# EAGLE design I2Sspeaker (EAGLE 7.6.0)
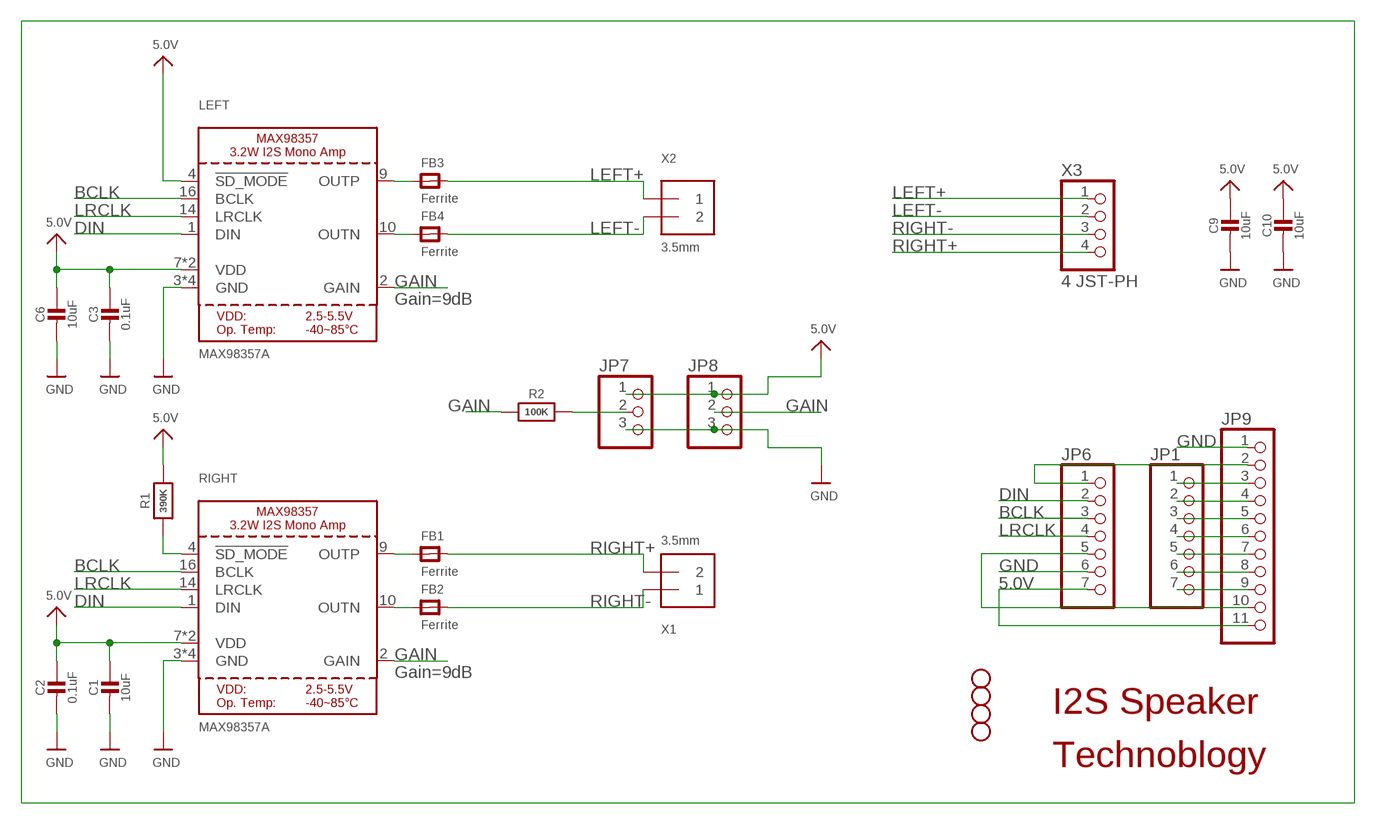
[diagram p0: schematic, sheet 1]

## Parts
C1  10uF  CAP_CERAMIC0805-NOOUTLINE  [0805-NO]
C2  0.1uF  CAP_CERAMIC0805-NOOUTLINE  [0805-NO]
C3  0.1uF  CAP_CERAMIC0805-NOOUTLINE  [0805-NO]
C6  10uF  CAP_CERAMIC0805-NOOUTLINE  [0805-NO]
C9  10uF  CAP_CERAMIC0805-NOOUTLINE  [0805-NO]
C10  10uF  CAP_CERAMIC0805-NOOUTLINE  [0805-NO]
FB1  Ferrite  FERRITE-0805NO  [0805-NO]
FB2  Ferrite  FERRITE-0805NO  [0805-NO]
FB3  Ferrite  FERRITE-0805NO  [0805-NO]
FB4  Ferrite  FERRITE-0805NO  [0805-NO]
JP1  HEADER-1X7ROUND  [1X07_ROUND]
JP2  STAND-OFF  [STAND-OFF]
JP3  STAND-OFF  [STAND-OFF]
JP4  STAND-OFF  [STAND-OFF]
JP5  STAND-OFF  [STAND-OFF]
JP6  HEADER-1X7ROUND  [1X07_ROUND]
JP7  HEADER-1X3ROUND  [1X03_ROUND]
JP8  HEADER-1X3ROUND  [1X03_ROUND]
JP9  HEADER-1X11  [1X11_ROUND]
LEFT  MAX98357A  AUDIOAMP_MAX98357  [QFN16_3MM]
R1  390K  RESISTOR0805_NOOUTLINE  [0805-NO]
R2  100K  RESISTOR0805_NOOUTLINE  [0805-NO]
RIGHT  MAX98357A  AUDIOAMP_MAX98357  [QFN16_3MM]
X1  3.5mm  TERMBLOCK_1X2  [TERMBLOCK_1X2-3.5MM]
X2  3.5mm  TERMBLOCK_1X2  [TERMBLOCK_1X2-3.5MM]
X3  4 JST-PH  CON_JST_PH_4PIN  [JSTPH4]

## Nets
5.0V: C1.1 C2.1 C3.1 C6.1 C9.1 C10.1 JP6.7 JP7.1 JP8.1 JP9.11 LEFT.4(!SD_MODE) LEFT.7(VDD) LEFT.8(VDD) R1.2 RIGHT.7(VDD) RIGHT.8(VDD)
BCLK: JP6.3 LEFT.16(BCLK) RIGHT.16(BCLK)
DIN: JP6.2 LEFT.1(DIN) RIGHT.1(DIN)
GAIN: JP8.2 LEFT.2(GAIN) R2.1 RIGHT.2(GAIN)
GND: C1.2 C2.2 C3.2 C6.2 C9.2 C10.2 JP6.6 JP7.3 JP8.3 JP9.1 LEFT.3(GND) LEFT.11(GND) LEFT.15(GND) LEFT.THERMAL(GND) RIGHT.3(GND) RIGHT.11(GND) RIGHT.15(GND) RIGHT.THERMAL(GND)
LEFT+: FB3.2 X2.1 X3.1
LEFT-: FB4.2 X2.2 X3.2
LRCLK: JP6.4 LEFT.14(LRCLK) RIGHT.14(LRCLK)
N$1: FB4.1 LEFT.10(OUTN)
N$2: FB3.1 LEFT.9(OUTP)
N$5: FB2.1 RIGHT.10(OUTN)
N$6: FB1.1 RIGHT.9(OUTP)
N$7: JP1.1 JP9.3
N$8: JP6.5 JP9.10
N$9: JP7.2 R2.2
N$10: JP1.2 JP9.4
N$11: JP1.3 JP9.5
N$12: JP1.4 JP9.6
N$13: JP1.5 JP9.7
N$14: JP1.6 JP9.8
N$15: JP1.7 JP9.9
N$16: JP6.1 JP9.2
RIGHT+: FB1.2 X1.2 X3.4
RIGHT-: FB2.2 X1.1 X3.3
SD_MODE: R1.1 RIGHT.4(!SD_MODE)

## Notes on the sheet
- Gain=9dB
- Gain=9dB
- I2S Speaker
- Technoblogy

## Library data of the parts
C1-C3 C6 C9 C10 = microbuilder:CAP_CERAMIC: Ceramic Capacitors For new designs, use the packages preceded by an '_' character since they are more reliable: The following footprints should be used on most boards: _0402 - Standard footprint for regular board layouts _0603 - Standard footprint for regular board layouts _0805 - Standard footprint for regular board layouts _1206 - Standard footprint for regular board layouts For extremely tight-pitch boards where space is at a premium, the following 'micro-pitch' footprints can be used (smaller pads, no silkscreen outline, etc.): _0402MP - Micro-pitch footprint for very dense/compact boards _0603MP - Micro-pitch footprint for very dense/compact boards _0805MP - Micro-pitch footprint for very dense/compact boards _1206MP - Micro-pitch footprint for very dense/compact boards
FB1-FB4 = microbuilder:FERRITE: Ferrite Bead 0603 MMZ1608B121C - 120 Ohm @ 100MHz, 600mA, 0.15 Ohm DC Resistance - Digikey: 445-2164-1-ND BK1608HW121-T - 120 Ohm, 600mA Ferrite Chip - Digikey: 587-1876-2-ND 0805 HZ0805B272R-10 - 2.7K Ohm @ 100MHz, 200mA, 0.8 Ohm DC Resistance - Digikey: 240-2504-1-ND (see also Murata BLM21BD272SN1L) MMZ2012Y152B - 1.5K Ohm @ 100MHz, 500mA, 0.4 Ohm DC Resistance - Digikey: 445-1560-1-ND - Mainly for high frequency (80-400MHz) MMZ2012R102A - 1K Ohm @ 100MHz, 500mA, 0.3 Ohm DC Resistance - Digikey: 445-1555-2-ND - More general purpose (10-200MHz)
JP1 JP6 = microbuilder:HEADER-1X7: PIN HEADER
JP2-JP5 = SparkFun:STAND-OFF: Stand Off This is the mechanical footprint for a #4 phillips button head screw. Use the keepout ring to avoid running the screw head into surrounding components. SKU : PRT-00447
JP7 JP8 = microbuilder:HEADER-1X3: PIN HEADER
JP9 = microbuilder:HEADER-1X11
LEFT RIGHT = microbuilder:AUDIOAMP_MAX98357: MAX98357 - 3.2W I2S Mono Audio Amp
R1 R2 = microbuilder:RESISTOR: Resistors For new designs, use the packages preceded by an '_' character since they are more reliable: The following footprints should be used on most boards: _0402 - Standard footprint for regular board layouts _0603 - Standard footprint for regular board layouts _0805 - Standard footprint for regular board layouts _1206 - Standard footprint for regular board layouts For extremely tight-pitch boards where space is at a premium, the following 'micro-pitch' footprints can be used (smaller pads, no silkscreen outline, etc.): _0402MP - Micro-pitch footprint for very dense/compact boards _0603MP - Micro-pitch footprint for very dense/compact boards _0805MP - Micro-pitch footprint for very dense/compact boards _1206MP - Micro-pitch footprint for very dense/compact boards
X1 X2 = microbuilder:TERMBLOCK_1X2: 3.5mm Terminal block http://www.ladyada.net/library/pcb/eaglelibrary.html
X3 = microbuilder:CON_JST_PH_4PIN: JST 4-Pin Right-Angle Connector 4UConnector: 17312

## Net classes
0 default: width 0.152 mm, drill 0.305 mm, clearance 0.152 mm

## Board
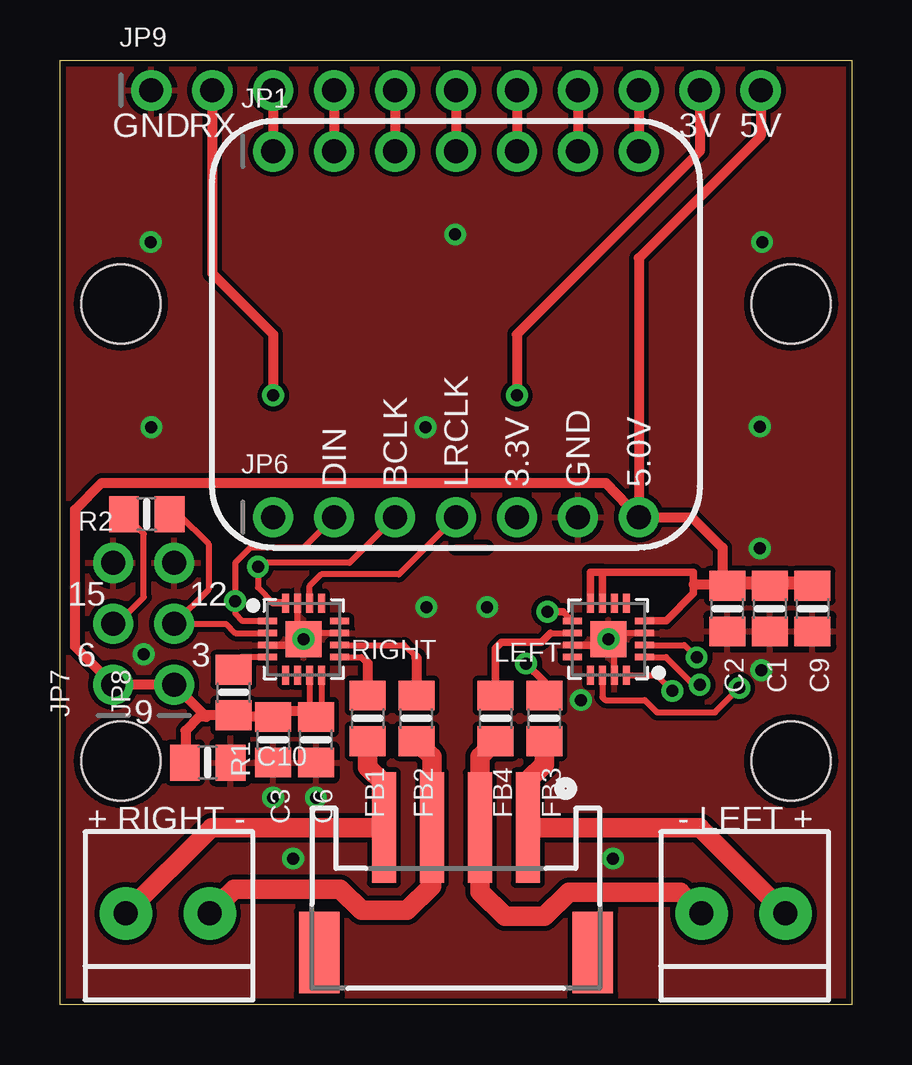
[diagram p1: board, top side]
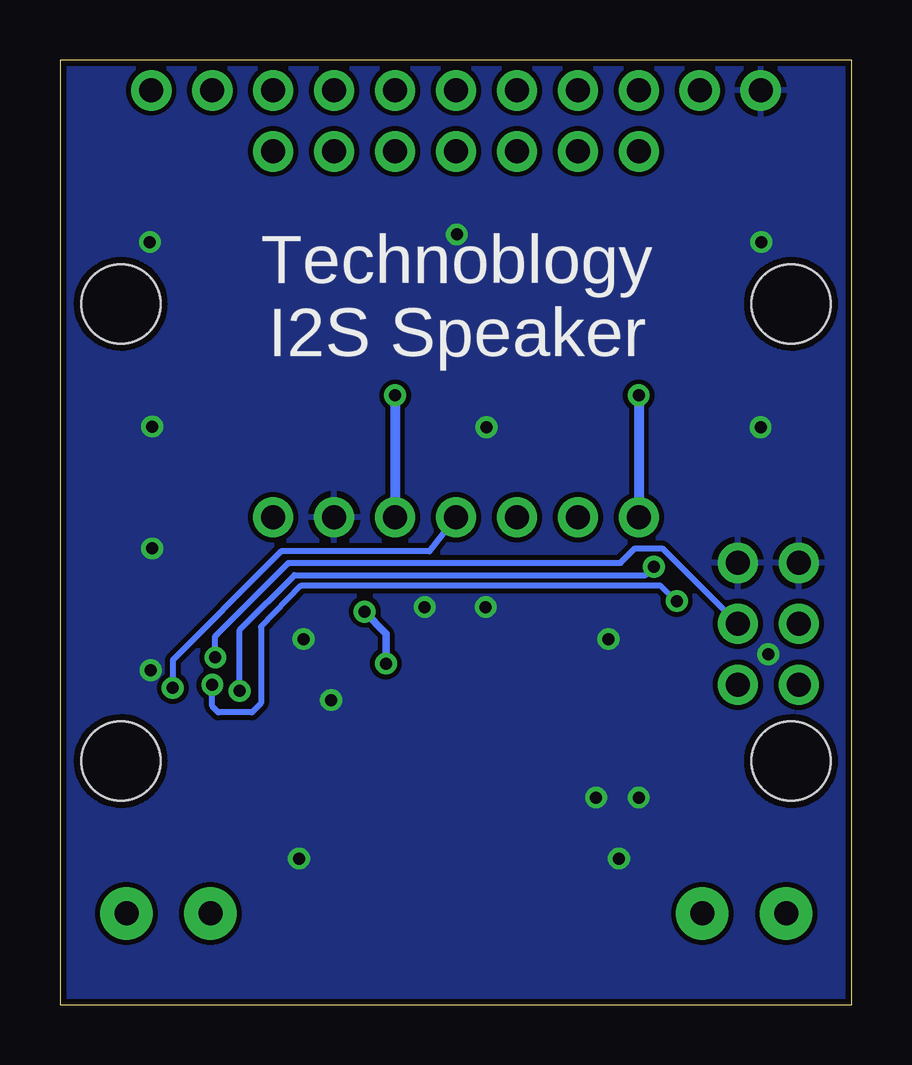
[diagram p2: board, bottom side, seen from below]

Size 33.02 x 39.37 mm. Coordinates in mm from the lower left corner, seen from the top.
Outline: 0,39.37 33.02,39.37 33.02,0 0,0 0,39.37
Copper layers (1*16): Top 0.035mm / dielectric 1.5mm / Bottom 0.035mm
Design rules "adafruit *": minimum track width 8mil, minimum drill 15.5mil, track to track 8mil, track to pad 8mil, pad to pad 8mil, via to via 8mil, smd to smd 8mil, copper to edge 10mil, drill to drill 8mil, minimum pad ring 10mil, minimum via ring 8mil, stop-mask expansion 2mil, vias tented up to drill 20mil, thermal gap 10mil

### Footprints (pad centres in the part's own frame; a part is rotated, then mirrored left to right if it is on the bottom)
0805-NO = smd 1.24 x 1.5: 1 -0.95,0; 2 0.95,0
1X07_ROUND = drill 1 pad 1.676: 1 -7.62,0; 2 -5.08,0; 3 -2.54,0; 4 0,0; 5 2.54,0; 6 5.08,0; 7 7.62,0
STAND-OFF = hole 3.302: 0,0
1X03_ROUND = drill 1 pad 1.676: 1 -2.54,0; 2 0,0; 3 2.54,0
1X11_ROUND = drill 1 pad 1.676: 1 -12.7,0; 2 -10.16,0; 3 -7.62,0; 4 -5.08,0; 5 -2.54,0; 6 0,0; 7 2.54,0; 8 5.08,0; 9 7.62,0; 10 10.16,0; 11 12.7,0
QFN16_3MM = smd 0.8 x 0.28: 1 -1.5,0.75; 2 -1.5,0.25; 3 -1.5,-0.25; 4 -1.5,-0.75; 9 1.5,-0.75; 10 1.5,-0.25; 11 1.5,0.25; 12 1.5,0.75 | smd 0.28 x 0.8: 5 -0.75,-1.5; 6 -0.25,-1.5; 7 0.25,-1.5; 8 0.75,-1.5; 13 0.75,1.5; 14 0.25,1.5; 15 -0.25,1.5; 16 -0.75,1.5 | smd 1.5 x 1.5: THERMAL 0,0
TERMBLOCK_1X2-3.5MM = drill 1 pad 2.184: 1 1.8,0; 2 -1.7,0
JSTPH4 = smd 1 x 4.6: 1 -3,-3.7; 2 -1,-3.7; 3 1,-3.7; 4 3,-3.7 | smd 1.7 x 3.4: NC1 -5.7,1.5; NC2 5.7,1.5

### Placement (x,y rotation side)
C1  29.59,16.51 270 top
C2  27.81,16.51 270 top
C3  8.89,11.05 270 top
C6  10.67,11.05 270 top
C9  31.37,16.51 270 top
C10  6.16,10.1 0 top
FB1  12.83,11.94 270 top
FB2  14.86,11.94 270 top
FB3  20.19,11.94 270 top
FB4  18.16,11.94 270 top
JP1  16.51,35.56 0 top
JP2  2.54,29.21 0 top
JP3  30.48,10.16 0 top
JP4  30.48,29.21 0 top
JP5  2.54,10.16 0 top
JP6  16.51,20.32 0 top
JP7  2.22,15.88 90 top
JP8  4.76,15.88 90 top
JP9  16.51,38.1 0 top
LEFT  22.86,15.24 180 top
R1  7.24,13.02 270 top
R2  3.62,20.45 180 top
RIGHT  10.16,15.24 0 top
X1  4.44,3.81 0 top
X2  28.45,3.81 0 top
X3  16.51,3.68 180 top

### Tracks (layer width: path | path; a pad name or v marks a point on that pad's centre or on a via)
5.0V
  Top 0.254: C3.1 9.14,12.25 9.14,12.32 | C2.1 27.75,17.53 | RIGHT.8 10.91,12.24 | 10.91,12.24 C6.1 | 10.91,12.24 10.16,12.24 10.41,12.49 RIGHT.7
  Top 0.305: LEFT.4 24.37,16 25.27,16 26.42,17.14 26.42,17.53 26.42,18.03 22.61,18.03 | LEFT.7 22.61,18.03 | 22.61,18.03 22.11,18.03 LEFT.8
  Top 0.406: 27.62,17.65 27.62,19.05 26.35,20.32 JP6.7 | 27.62,17.65 C2.1 | JP6.7 22.77,21.75 1.75,21.75 0.63,20.64 0.63,14.92 JP7.1 JP8.1 6.03,12.07 | R1.2 | 29.52,17.53 31.3,17.53 C9.1 31.18,17.65 27.62,17.65 | 26.42,17.53 29.52,17.53 | 29.52,17.53 C1.1 | C10.1 5.24,10.13 5.24,11.43 5.81,12 6.1,12 6.03,12.07 | R1.2 7.31,12 C3.1 9.13,12.24 10.16,12.24 | R1.2 6.03,12.07 | JP9.11 29.21,36.2 24.13,31.11 JP6.7
BCLK  (via drill 0.5)
  Top 0.254: LEFT.16 24.87,13.74 v25.53,13.08 | JP6.3 12.06,18.41 8.41,18.41 v8.26,18.26 8.26,17.4 8.89,16.76
  Top 0.305: 8.89,16.76 9.39,16.76 RIGHT.16
  Bottom 0.254: v25.53,13.08 25.53,15.62 23.24,17.91 8.6,17.91 v8.26,18.26
DIN  (via drill 0.5)
  Top 0.254: RIGHT.1 7.62,15.99 7.3,16.31 v7.3,16.83 7.3,18.41 7.94,19.05 10.16,19.05 JP6.2 | LEFT.1 25.26,14.49 26.42,13.34 v26.67,13.34
  Bottom 0.254: v7.3,16.83 7.97,17.46 22.99,17.46 24.64,15.75 24.64,12.57 25.02,12.19 26.42,12.19 26.67,12.45 v26.67,13.34
GAIN  (via drill 0.5)
  Top 0.254: LEFT.2 26.03,14.99 v26.54,14.48 | RIGHT.2 7.3,15.49 6.92,15.88 JP8.2 6.19,17.3 6.19,19.21 4.95,20.45 R2.1
  Bottom 0.254: v26.54,14.48 26.54,15.37 23.49,18.41 9.65,18.41 9.05,19.02 7.91,19.02 JP8.2
GND  (via drill 0.5)
  Top 0.254: LEFT.15 23.11,14.99 LEFT.THERMAL 23.11,15.49 LEFT.3 | RIGHT.11 10.41,15.49 | 10.41,15.49 RIGHT.THERMAL | 10.41,15.49 9.91,15.49 RIGHT.15
  Top 0.305: RIGHT.3 10.16,14.99 RIGHT.THERMAL | LEFT.11 22.86,14.99 LEFT.THERMAL
  other vias: 8.89,8.64 10.67,8.64 10.16,15.24 22.86,15.24 21.72,12.7 3.81,24.07 23.05,6.1 29.18,24.1 29.24,13.94 15.27,16.57 29.27,31.78 3.78,31.78 9.72,6.1 17.81,16.57 3.49,14.61 29.18,19.02 15.24,24.07 16.48,32.1
  pour Top: 0,39.37 0,0 33.02,0 33.02,39.37
  pour Bottom: 0,39.37 0,0 33.02,0 33.02,39.37
LEFT+
  Top 0.305: 20.25,11.05 FB3.2
  Top 0.813: X2.1 26.67,7.38 X3.1 19.56,7.43 19.56,9.4 20.19,10.03 FB3.2
LEFT-
  Top 0.305: 17.51,10.68 17.51,10.34
  Top 0.813: X2.2 25.86,4.7 21.21,4.7 20.19,3.68 18.54,3.68 17.51,4.71 X3.2 17.51,10.34 FB4.2
LRCLK  (via drill 0.5)
  Top 0.254: LEFT.14 22.61,12.82 22.73,12.7 24.38,12.7 24.89,12.19 27.3,12.19 v28.32,13.21 | RIGHT.14 10.41,17.46 10.89,17.94 14.13,17.94 JP6.4
  Bottom 0.254: v28.32,13.21 28.32,14.35 24.13,18.57 23.81,18.89 17.62,18.89 JP6.4
N$1
  Top 0.254: 20.44,15.49 LEFT.10
  Top 0.305: FB4.1 18.16,14.86 18.41,15.11 20.07,15.11 20.44,15.49
N$2  (via drill 0.5)
  Top 0.254: LEFT.9 20.97,16.38
  Top 0.305: 19.56,13.97 v19.43,14.22 20.19,13.46 FB3.1 | 20.97,16.38 v20.32,16.38
  Bottom 0.305: v20.32,16.38 19.43,15.46 v19.43,14.22
N$3
  Top 0.254: 17.78,19.05 16.51,19.05
N$5
  Top 0.254: RIGHT.10 14.35,14.99 14.86,14.48
  Top 0.406: 14.86,14.48 FB2.1
N$6
  Top 0.254: RIGHT.9 12.56,14.49 12.83,14.22
  Top 0.406: 12.83,14.22 FB1.1
N$7
  Top 0.406: JP9.3 JP1.1
N$8  (via drill 0.5)
  Top 0.406: JP9.10 26.67,35.56 19.05,27.94 v19.05,25.4
  Bottom 0.406: v19.05,25.4 JP6.5
N$9
  Top 0.254: JP7.2 2.38,15.88 3.49,16.99 3.49,19.62 R2.2
N$10
  Top 0.406: JP9.4 JP1.2
N$11
  Top 0.406: JP9.5 JP1.3
N$12
  Top 0.406: JP9.6 JP1.4
N$13
  Top 0.406: JP9.7 JP1.5
N$14
  Top 0.406: JP9.8 JP1.6
N$15
  Top 0.406: JP9.9 JP1.7
N$16  (via drill 0.5)
  Top 0.406: JP9.2 6.35,30.48 8.89,27.94 v8.89,25.4
  Bottom 0.406: v8.89,25.4 JP6.1
RIGHT+
  Top 0.406: 6.35,7.42 6.32,7.38
  Top 0.813: X1.2 6.32,7.38 X3.4 13.46,7.43 13.46,9.27 12.83,9.91 FB1.2
RIGHT-
  Top 0.305: 15.34,10.64 15.21,10.64
  Top 0.813: X1.1 7.26,4.83 11.68,4.83 12.57,3.94 14.48,3.94 15.49,4.95 15.49,7.37 X3.3 15.51,10.34 15.21,10.64 FB2.2
SD_MODE
  Top 0.254: RIGHT.4 7.57,14.49 R1.1

### Text on the board
tPlace: GND | RX | 3V | 5V | DIN | BCLK | LRCLK | 3.3V | GND | 5.0V | 15 | 12 | 6 | 3 | 9 | + RIGHT - | - LEFT +
bPlace: Technoblogy / I2S Speaker